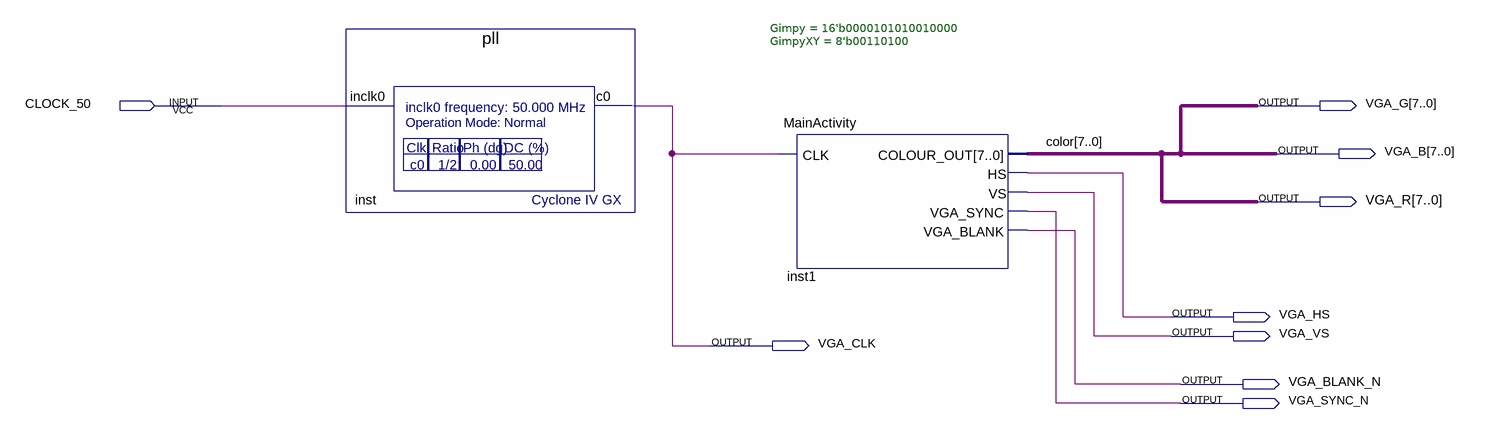
[diagram p0: schematic sheet]
// Quartus schematic VGA.bdf as structural Verilog: 2 symbols, 9 pins
module VGA (
  input  CLOCK_50,
  output [7:0] VGA_G,
  output [7:0] VGA_B,
  output [7:0] VGA_R,
  output VGA_HS,
  output VGA_VS,
  output VGA_CLK,
  output VGA_BLANK_N,
  output VGA_SYNC_N
);

  pll inst (.inclk0(CLOCK_50), .c0(VGA_CLK));
  MainActivity #(.Gimpy(16'b0000101010010000), .GimpyXY(8'b00110100)) inst1 (
    .CLK(VGA_CLK), .COLOUR_OUT(VGA_B), .HS(VGA_HS), .VS(VGA_VS), .VGA_SYNC(VGA_SYNC_N),
    .VGA_BLANK(VGA_BLANK_N));

  assign VGA_G = VGA_B;
  assign VGA_R = VGA_B;

  // Other names for the same wires on the sheet: color[7:0] = VGA_B
endmodule
